# EAGLE design rc2014_6809 (EAGLE 8.1.1)
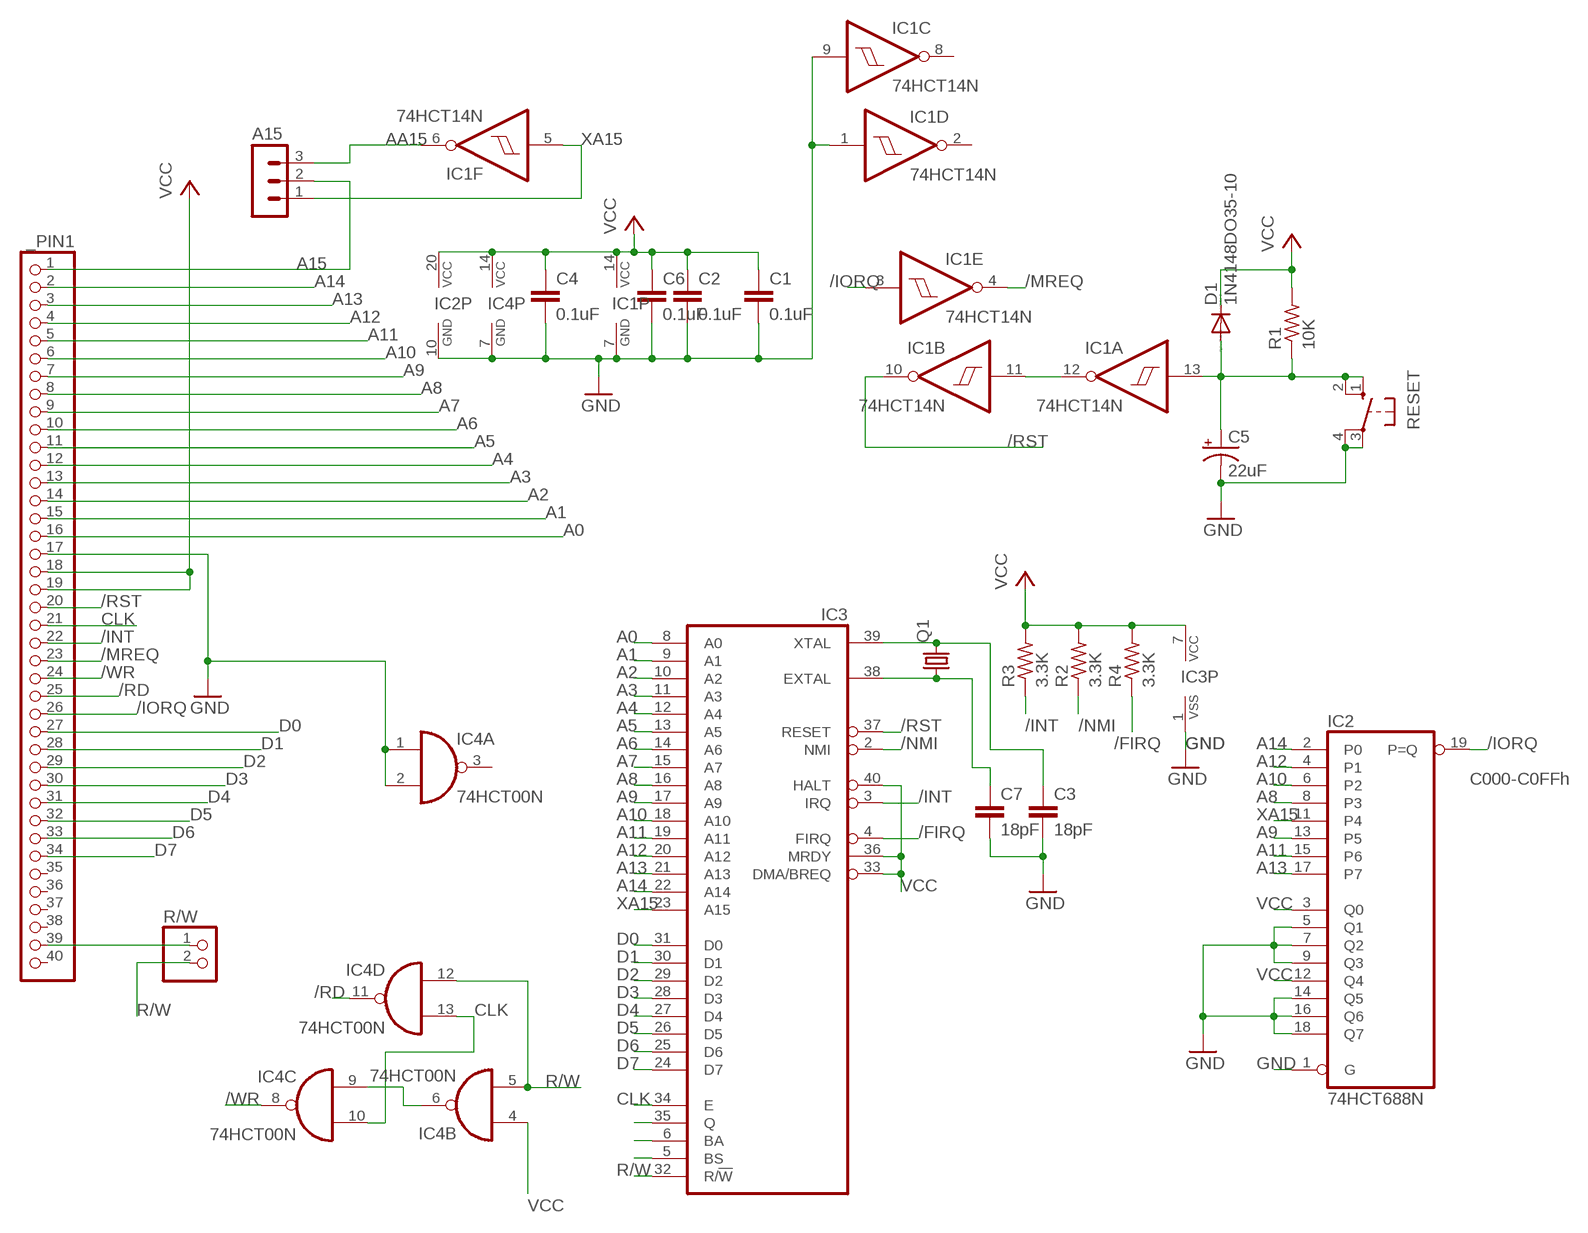
[diagram p0: schematic, sheet 1]

## Parts
_PIN1  PINHD-1X40  [1X40]
A15  MA03-1  [MA03-1]
C1  0.1uF  C-EU050-024X044  [C050-024X044]
C2  0.1uF  C-EU050-024X044  [C050-024X044]
C3  18pF  C-EU050-024X044  [C050-024X044]
C4  0.1uF  C-EU050-024X044  [C050-024X044]
C5  22uF  CPOL-USTAP5-80  [TAP5-80]
C6  0.1uF  C-EU050-024X044  [C050-024X044]
C7  18pF  C-EU050-024X044  [C050-024X044]
D1  1N4148DO35-10  [DO35-10]
IC1  74HCT14N  [DIL14]
IC2  74HCT688N  [DIL20]
IC3  6809  [DIL40]
IC4  74HCT00N  [DIL14]
Q1  CRYSTALHC49S  [HC49/S]
R1  10K  R-US_0207/10  [0207/10]
R2  3.3K  R-US_0207/10  [0207/10]
R3  3.3K  R-US_0207/10  [0207/10]
R4  3.3K  R-US_0207/10  [0207/10]
R/W  PINHD-1X2  [1X02]
RESET  10-XX  [B3F-10XX]

## Nets
/FIRQ: IC3.4(FIRQ) R4.1
/INT: _PIN1.22 IC3.3(IRQ) R3.1
/IORQ: _PIN1.26 IC1.3(E:I) IC2.19(P=Q)
/MREQ: _PIN1.23 IC1.4(E:O)
/NMI: IC3.2(NMI) R2.1
/RD: _PIN1.25 IC4.11(D:O)
/RST: _PIN1.20 IC1.10(B:O) IC3.37(RESET)
/WR: _PIN1.24 IC4.8(C:O)
A0: _PIN1.16 IC3.8(A0)
A1: _PIN1.15 IC3.9(A1)
A2: _PIN1.14 IC3.10(A2)
A3: _PIN1.13 IC3.11(A3)
A4: _PIN1.12 IC3.12(A4)
A5: _PIN1.11 IC3.13(A5)
A6: _PIN1.10 IC3.14(A6)
A7: _PIN1.9 IC3.15(A7)
A8: _PIN1.8 IC2.8(P3) IC3.16(A8)
A9: _PIN1.7 IC2.13(P5) IC3.17(A9)
A10: _PIN1.6 IC2.6(P2) IC3.18(A10)
A11: _PIN1.5 IC2.15(P6) IC3.19(A11)
A12: _PIN1.4 IC2.4(P1) IC3.20(A12)
A13: _PIN1.3 IC2.17(P7) IC3.21(A13)
A14: _PIN1.2 IC2.2(P0) IC3.22(A14)
A15: _PIN1.1 A15.2
AA15: A15.3 IC1.6(F:O)
CLK: _PIN1.21 IC3.34(E) IC4.10(C:I1) IC4.13(D:I1)
D0: _PIN1.27 IC3.31(D0)
D1: _PIN1.28 IC3.30(D1)
D2: _PIN1.29 IC3.29(D2)
D3: _PIN1.30 IC3.28(D3)
D4: _PIN1.31 IC3.27(D4)
D5: _PIN1.32 IC3.26(D5)
D6: _PIN1.33 IC3.25(D6)
D7: _PIN1.34 IC3.24(D7)
GND: _PIN1.17 C1.2 C2.2 C3.2 C4.2 C5.- C6.2 C7.2 IC1.1(D:I) IC1.7(P:GND) IC1.9(C:I) IC2.1(G) IC2.5(Q1) IC2.7(Q2) IC2.9(Q3) IC2.10(GND) IC2.14(Q5) IC2.16(Q6) IC2.18(Q7) IC3.1(VSS) IC4.1(A:I0) IC4.2(A:I1) IC4.7(P:GND) RESET.3(P) RESET.4(P1)
N$1: IC4.6(B:O) IC4.9(C:I0)
N$3: IC3.5(BS)
N$4: IC3.6(BA)
N$5: IC3.35(Q)
N$6: _PIN1.39 R/W.1
N$15: IC1.11(B:I) IC1.12(A:O)
N$32: C3.1 IC3.39(XTAL) Q1.2
N$33: C7.1 IC3.38(EXTAL) Q1.1
R/W: IC3.32(R/!W) IC4.5(B:I1) IC4.12(D:I0) R/W.2
RESET: C5.+ D1.A IC1.13(A:I) R1.1 RESET.1(S) RESET.2(S1)
VCC: _PIN1.18 _PIN1.19 C1.1 C2.1 C4.1 C6.1 D1.C IC1.14(P:VCC) IC2.3(Q0) IC2.12(Q4) IC2.20(VCC) IC3.7(VCC) IC3.33(DMA/BREQ) IC3.36(MRDY) IC3.40(HALT) IC4.4(B:I0) IC4.14(P:VCC) R1.2 R2.2 R3.2 R4.2
XA15: A15.1 IC1.5(F:I) IC2.11(P4) IC3.23(A15)
Unconnected: _PIN1.35 _PIN1.36 _PIN1.37 _PIN1.38 _PIN1.40 IC1.2(D:O) IC1.8(C:O) IC4.3(A:O)

## Notes on the sheet
- C000-C0FFh

## Library data of the parts
_PIN1 = pinhead:PINHD-1X40: PIN HEADER
A15 = con-lstb:MA03-1: PIN HEADER; OC_FARNELL: unknown; OC_NEWARK: unknown
C1-C4 C6 C7 = rcl:C-EU: CAPACITOR, European symbol
C5 = rcl:CPOL-US: POLARIZED CAPACITOR, American symbol
D1 = diode:1N4148: DIODE high speed (Philips)
IC1 = 74xx-eu:74*14: Hex schmitt trigger INVERTER
IC2 = 74xx-eu:74*688: 8-bit MAGNITUDE/IDENTITY COMPARATOR, totem pole
IC3 = micro-motorola:6809: MICROCONTROLLER/MEMORY DEVICE; MF: NTE ELECTRONICS; MPN: NTE6809; OC_FARNELL: 4530354; OC_NEWARK: 31C2459
IC4 = 74xx-eu:74*00: Quad 2-input NAND gate
Q1 = crystal:CRYSTAL: CRYSTAL; OC_FARNELL: 1667008; OC_NEWARK: unknown
R1-R4 = rcl:R-US_: RESISTOR, American symbol
R/W = pinhead:PINHD-1X2: PIN HEADER
RESET = switch-omron:10-XX: OMRON SWITCH; MPN: B3F-1000; OC_FARNELL: 176432; OC_NEWARK: 36M3542

## Net classes
0 +5V: width 0.508 mm

## Board
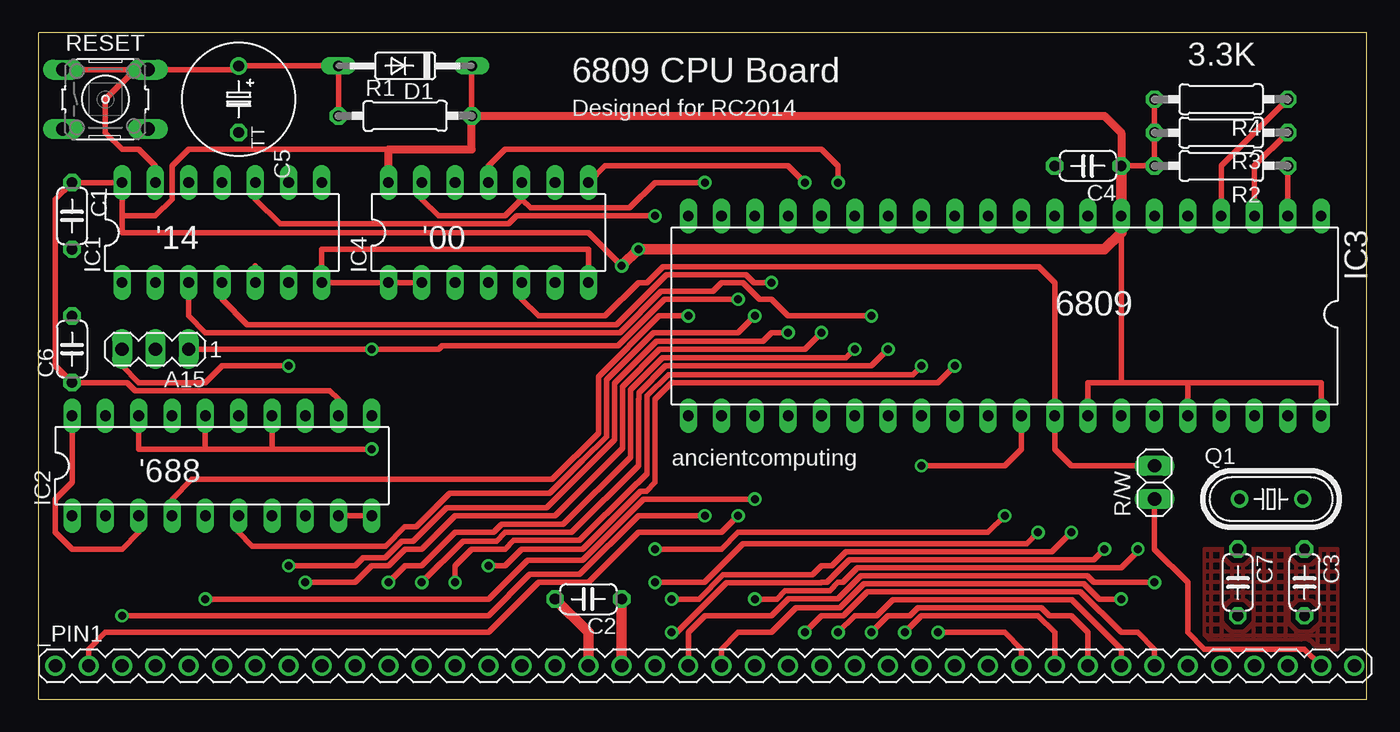
[diagram p1: board, top side]
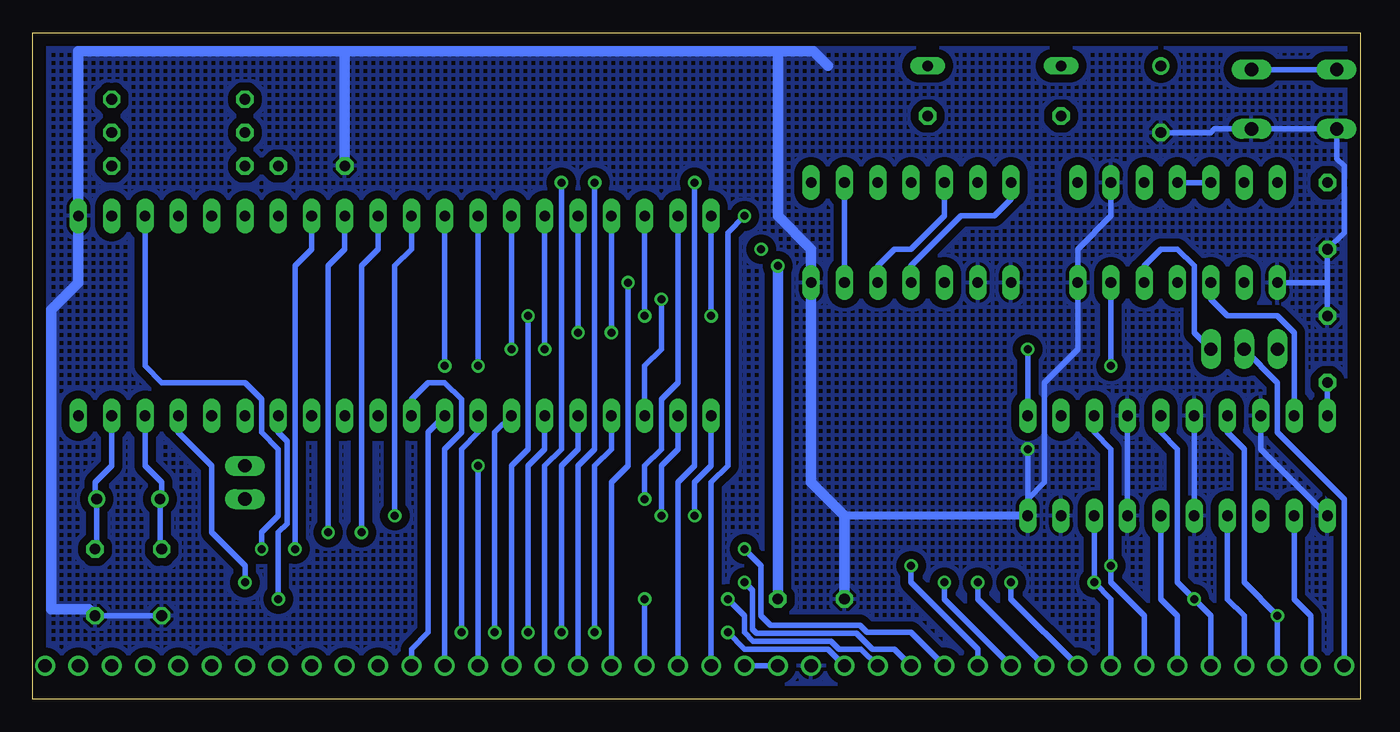
[diagram p2: board, bottom side, seen from below]

Size 101.27 x 50.79 mm. Coordinates in mm from the lower left corner, seen from the top.
Outline: 0,0 101.27,0 101.27,50.79 0,50.79 0,0
Copper layers (1*16): Top 0.035mm / dielectric 1.5mm / Bottom 0.035mm
Design rules "default *": minimum track width 20mil, minimum drill 24mil, track to track 8mil, track to pad 8mil, pad to pad 8mil, via to via 8mil, smd to smd 8mil, copper to edge 40mil, drill to drill 8mil, minimum pad ring 10mil, minimum via ring 8mil, stop-mask expansion 4mil, vias tented up to drill 0mil, thermal gap 10mil

### Footprints (pad centres in the part's own frame; a part is rotated, then mirrored left to right if it is on the bottom)
1X40 = drill 1.016: 1 -49.53,0; 2 -46.99,0; 3 -44.45,0; 4 -41.91,0; 5 -39.37,0; 6 -36.83,0; 7 -34.29,0; 8 -31.75,0; 9 -29.21,0; 10 -26.67,0; 11 -24.13,0; 12 -21.59,0; 13 -19.05,0; 14 -16.51,0; 15 -13.97,0; 16 -11.43,0; 17 -8.89,0; 18 -6.35,0; 19 -3.81,0; 20 -1.27,0; 21 1.27,0; 22 3.81,0; 23 6.35,0; 24 8.89,0; 25 11.43,0; 26 13.97,0; 27 16.51,0; 28 19.05,0; 29 21.59,0; 30 24.13,0; 31 26.67,0; 32 29.21,0; 33 31.75,0; 34 34.29,0; 35 36.83,0; 36 39.37,0; 37 41.91,0; 38 44.45,0; 39 46.99,0; 40 49.53,0
MA03-1 = drill 1.016 long: 1 -2.54,0; 2 0,0; 3 2.54,0
C050-024X044 = drill 0.813 octagon: 1 -2.54,0; 2 2.54,0
TAP5-80 = drill 0.813: + -2.54,0 | drill 0.813 octagon: - 2.54,0
DO35-10 = drill 0.813 long: A 5.08,0; C -5.08,0
DIL14 = drill 0.813 long: 1 -7.62,-3.81; 2 -5.08,-3.81; 3 -2.54,-3.81; 4 0,-3.81; 5 2.54,-3.81; 6 5.08,-3.81; 7 7.62,-3.81; 8 7.62,3.81; 9 5.08,3.81; 10 2.54,3.81; 11 0,3.81; 12 -2.54,3.81; 13 -5.08,3.81; 14 -7.62,3.81
DIL20 = drill 0.813 long: 1 -11.43,-3.81; 2 -8.89,-3.81; 3 -6.35,-3.81; 4 -3.81,-3.81; 5 -1.27,-3.81; 6 1.27,-3.81; 7 3.81,-3.81; 8 6.35,-3.81; 9 8.89,-3.81; 10 11.43,-3.81; 11 11.43,3.81; 12 8.89,3.81; 13 6.35,3.81; 14 3.81,3.81; 15 1.27,3.81; 16 -1.27,3.81; 17 -3.81,3.81; 18 -6.35,3.81; 19 -8.89,3.81; 20 -11.43,3.81
DIL40 = drill 0.813 long: 1 -24.13,-7.62; 2 -21.59,-7.62; 3 -19.05,-7.62; 4 -16.51,-7.62; 5 -13.97,-7.62; 6 -11.43,-7.62; 7 -8.89,-7.62; 8 -6.35,-7.62; 9 -3.81,-7.62; 10 -1.27,-7.62; 11 1.27,-7.62; 12 3.81,-7.62; 13 6.35,-7.62; 14 8.89,-7.62; 15 11.43,-7.62; 16 13.97,-7.62; 17 16.51,-7.62; 18 19.05,-7.62; 19 21.59,-7.62; 20 24.13,-7.62; 21 24.13,7.62; 22 21.59,7.62; 23 19.05,7.62; 24 16.51,7.62; 25 13.97,7.62; 26 11.43,7.62; 27 8.89,7.62; 28 6.35,7.62; 29 3.81,7.62; 30 1.27,7.62; 31 -1.27,7.62; 32 -3.81,7.62; 33 -6.35,7.62; 34 -8.89,7.62; 35 -11.43,7.62; 36 -13.97,7.62; 37 -16.51,7.62; 38 -19.05,7.62; 39 -21.59,7.62; 40 -24.13,7.62
HC49/S = drill 0.813: 1 -2.413,0; 2 2.413,0
0207/10 = drill 0.813 octagon: 1 -5.08,0; 2 5.08,0
1X02 = drill 1.016 long: 1 -1.27,0; 2 1.27,0
B3F-10XX = drill 1.016 long: 1 -3.251,2.261; 2 3.251,2.261; 3 -3.251,-2.261; 4 3.251,-2.261

### Placement (x,y rotation side)
_PIN1  50.8,2.54 0 top
A15  8.89,26.67 180 top
C1  2.54,36.83 270 top
C2  41.91,7.62 180 top
C3  96.52,8.89 270 top
C4  80.01,40.64 180 top
C5  15.24,45.72 270 top
C6  2.54,26.67 90 top
C7  91.44,8.89 270 top
D1  27.94,48.26 180 top
IC1  13.97,35.56 0 top
IC2  13.97,17.78 0 top
IC3  73.66,29.21 180 top
IC4  34.29,35.56 0 top
Q1  93.98,15.24 0 top
R1  27.94,44.45 0 top
R2  90.17,40.64 180 top
R3  90.17,43.18 180 top
R4  90.17,45.72 180 top
R/W  85.09,16.51 90 top
RESET  5.08,45.72 0 top

### Tracks (layer width: path | path; a pad name or v marks a point on that pad's centre or on a via)
/FIRQ
  Top 0.406: R4.1 90.17,40.64 IC3.4
/INT  (via drill 0.61)
  Top 0.406: v54.61,7.62 56.29,7.62 56.92,8.25 60.32,8.25 60.96,8.89 61.32,8.89 62.44,10.01 82.55,10.01 83.82,11.28 v83.82,11.43 | R3.1 92.71,40.64 IC3.3
  Bottom 0.406: _PIN1.22 v54.61,7.62 | IC3.3 92.71,25.4 91.44,24.13 85.09,24.13 83.82,22.86 83.82,20.32 82.55,19.05 82.55,13.97 83.82,12.7 v83.82,11.43
/IORQ  (via drill 0.61)
  Top 0.406: IC1.3 11.43,29.21 12.7,27.94 44.31,27.94 47.46,31.09 51.41,31.09 52.07,31.75 53.7,31.75 54.97,30.48 55.88,30.48 57.15,29.21 v63.5,29.21
  Bottom 0.406: _PIN1.26 64.77,17.78 63.5,19.05 v63.5,29.21 | IC1.3 11.43,30.48 10.16,29.21 6.35,29.21 5.08,27.94 IC2.19
/MREQ  (via drill 0.61)
  Top 0.406: IC1.4 13.97,30.48 15.9,28.55 44.06,28.55 47.87,32.36 53.95,32.36 54.56,31.75 v55.88,31.75
  Bottom 0.406: _PIN1.23 57.15,16.51 55.88,17.78 v55.88,31.75
/NMI
  Top 0.406: R2.1 IC3.2
/RD  (via drill 0.61)
  Top 0.406: v60.96,39.37 60.96,40.64 59.69,41.91 35.56,41.91 34.29,40.64 IC4.11
  Bottom 0.406: _PIN1.25 62.23,17.78 60.96,19.05 v60.96,39.37
/RST  (via drill 0.61)
  Top 0.406: v85.09,8.89 80.46,8.89 79.96,9.4 62.69,9.4 60.94,7.64 57.17,7.64 55.88,6.35 50.8,6.35 49.53,5.08 _PIN1.20 | v46.99,36.83 36.42,36.83 35.81,36.22 18.39,36.22 16.51,38.1 IC1.10
  Bottom 0.406: IC3.37 90.17,20.32 87.63,17.78 87.63,12.7 85.09,10.16 v85.09,8.89 | _PIN1.20 49.53,16.51 48.26,17.78 48.26,35.56 v46.99,36.83
/WR  (via drill 0.61)
  Top 0.406: v58.42,39.37 57.15,40.64 43.18,40.64 IC4.8
  Bottom 0.406: _PIN1.24 59.69,17.78 58.42,19.05 v58.42,39.37
A0  (via drill 0.61)
  Top 0.406: v48.26,5.08 48.67,5.08 52.45,8.86 59.66,8.86 59.69,8.89 60.1,8.89 61.83,10.62 80.47,10.62 v81.28,11.43
  Bottom 0.406: _PIN1.16 40.64,3.81 46.99,3.81 v48.26,5.08 | IC3.8 80.01,34.29 81.28,33.02 v81.28,11.43
A1  (via drill 0.61)
  Top 0.406: v48.26,7.62 50.35,7.62 52.2,9.47 59,9.47 59.69,10.16 60.51,10.16 61.57,11.23 77.27,11.23 v78.74,12.7
  Bottom 0.406: _PIN1.15 38.1,3.81 39.78,3.81 40.39,4.42 46.33,4.42 46.99,5.08 46.99,6.35 v48.26,7.62 | IC3.9 77.47,34.29 78.74,33.02 v78.74,12.7
A2  (via drill 0.61)
  Top 0.406: v46.99,8.89 50.75,8.89 53.7,11.84 75.34,11.84 v76.2,12.7
  Bottom 0.406: _PIN1.14 35.56,3.81 37.24,3.81 38.46,5.03 46.08,5.03 46.38,5.33 46.38,8.28 v46.99,8.89 | IC3.10 74.93,34.29 76.2,33.02 v76.2,12.7
A3  (via drill 0.61)
  Top 0.406: v46.99,11.43 52.07,11.43 53.34,12.7 72.39,12.7 v73.66,13.97
  Bottom 0.406: IC3.11 72.39,34.29 73.66,33.02 v73.66,13.97 | _PIN1.13 34.29,5.08 37.65,5.08 38.2,5.64 45.01,5.64 45.72,6.35 45.72,10.16 v46.99,11.43
A4  (via drill 0.61)
  Top 0.406: v69.85,25.4 68.58,24.13 48.26,24.13 46.99,22.86 46.99,16.51 46.33,15.85 45.88,15.85 41.46,11.43 36.83,11.43 35.56,10.16 v34.29,10.16
  Bottom 0.406: IC3.12 v69.85,25.4 | _PIN1.12 29.21,3.81 34.29,8.89 v34.29,10.16
A5  (via drill 0.61)
  Top 0.406: v67.31,25.4 66.65,24.74 48.01,24.74 46.38,23.11 46.38,17.17 45.67,16.46 45.62,16.46 45.27,16.1 | 45.27,16.1 | 45.27,16.1 41.25,12.09 36.22,12.09 35.56,11.43 33.02,11.43 31.75,10.16 v31.75,8.89
  Bottom 0.406: _PIN1.11 31.75,7.62 v31.75,8.89 | IC3.13 v67.31,25.4
A6  (via drill 0.61)
  Top 0.406: v64.77,26.67 63.5,25.4 47.81,25.4 45.77,23.36 45.77,22.91 45.72,22.86 45.72,17.78 40.64,12.7 35.56,12.7 34.9,12.04 32.36,12.04 v29.21,8.89
  Bottom 0.406: _PIN1.10 29.21,7.62 v29.21,8.89 | IC3.14 v64.77,26.67
A7  (via drill 0.61)
  Top 0.406: v26.67,8.89 27.94,10.16 29.21,10.16 31.75,12.7 34.7,12.7 35.31,13.31 39.98,13.31 45.11,18.44 45.11,23.57 47.55,26.01 61.57,26.01 v62.23,26.67
  Bottom 0.406: _PIN1.9 26.67,7.62 v26.67,8.89 | IC3.15 v62.23,26.67
A8  (via drill 0.61)
  Top 0.406: v59.69,27.94 58.42,26.67 47.35,26.67 44.5,23.82 44.5,19.1 39.37,13.97 31.75,13.97 29.21,11.43 27.94,11.43 26.67,10.16 25.4,10.16 24.13,8.89 v20.32,8.89
  Bottom 0.406: _PIN1.8 19.05,7.62 v20.32,8.89 IC2.8 | IC3.16 v59.69,27.94
A9  (via drill 0.61)
  Top 0.406: v57.15,27.94 55.88,27.94 55.22,27.28 47.1,27.28 43.89,24.07 43.89,19.76 38.71,14.58 31.09,14.58 28.55,12.04 27.69,12.04 26.42,10.77 24.74,10.77 24.13,10.16 v19.05,10.16
  Bottom 0.406: IC3.17 v57.15,27.94 | _PIN1.7 16.51,6.35 19.05,8.89 v19.05,10.16 19.05,19.05 20.32,20.32 IC2.13
A10  (via drill 0.61)
  Top 0.406: v54.61,29.21 53.34,27.94 46.9,27.94 43.28,24.32 43.28,20.01 41.48,18.21 38.94,15.67 31.32,15.67 28.78,13.13 27.92,13.13 26.44,11.66 16.28,11.66 15.24,12.7 IC2.6
  Bottom 0.406: _PIN1.6 13.97,6.35 15.24,7.62 IC2.6 | IC3.18 v54.61,29.21
A11  (via drill 0.61)
  Top 0.406: v54.61,15.24 46.13,15.24 41.48,10.59 37.26,10.59 34.29,7.62 v12.7,7.62
  Bottom 0.406: IC3.19 52.07,24.13 53.34,22.86 53.34,19.05 54.61,17.78 v54.61,15.24 | _PIN1.5 11.43,6.35 v12.7,7.62 13.97,8.89 13.97,19.05 15.24,20.32 IC2.15
A12  (via drill 0.61)
  Top 0.406: v49.53,29.21 47.3,29.21 42.67,24.58 42.67,20.27 39.14,16.74 11.66,16.74 10.16,15.24 IC2.4
  Bottom 0.406: _PIN1.4 8.89,6.35 10.16,7.62 IC2.4 | IC3.20 v49.53,29.21
A13  (via drill 0.61)
  Top 0.406: v50.8,13.97 45.72,13.97 41.25,9.5 37.44,9.5 34.29,6.35 v6.35,6.35
  Bottom 0.406: _PIN1.3 v6.35,6.35 8.89,8.89 8.89,19.05 10.16,20.32 IC2.17 | IC3.21 49.53,17.78 50.8,16.51 v50.8,13.97
A14  (via drill 0.61)
  Top 0.406: v53.34,13.97 52.07,12.7 45.72,12.7 41.91,8.89 38.1,8.89 34.29,5.08 5.08,5.08 3.81,3.81 _PIN1.2
  Bottom 0.406: _PIN1.2 3.81,6.35 5.08,7.62 IC2.2 | IC3.22 52.07,19.05 53.34,17.78 v53.34,13.97
A15
  Bottom 0.406: A15.2 6.35,24.13 6.35,20.32 1.27,15.24 _PIN1.1
AA15  (via drill 0.61)
  Top 0.406: A15.3 6.35,25.4 7.62,24.13 12.7,24.13 13.97,25.4 v19.05,25.4
  Bottom 0.406: IC1.6 v19.05,25.4
CLK  (via drill 0.61)
  Top 0.406: v82.55,7.62 80.87,7.62 79.7,8.79 62.94,8.79 61.12,6.96 57.76,6.96 55.88,5.08 53.34,5.08 52.07,3.81 _PIN1.21 | IC4.13 29.21,38.1 30.48,36.83 35.56,36.83 36.83,38.1 | 36.83,38.1 IC4.10 | v50.8,39.37 46.99,39.37 45.06,37.44 37.49,37.44 36.83,38.1
  Bottom 0.406: _PIN1.21 52.07,16.51 50.8,17.78 v50.8,39.37 | IC3.34 82.55,20.32 81.89,19.66 81.89,13.36 82.55,12.7 v82.55,7.62
D0  (via drill 0.61)
  Top 0.406: v67.31,17.78 73.66,17.78 74.93,19.05 IC3.31
  Bottom 0.406: v67.31,17.78 _PIN1.27
D1
  Bottom 0.406: _PIN1.28 69.85,19.05 68.58,20.32 68.58,22.86 69.85,24.13 71.12,24.13 72.39,22.86 IC3.30
D2
  Bottom 0.406: IC3.29 71.12,20.32 71.12,5.08 72.39,3.81 _PIN1.29
D3  (via drill 0.61)
  Top 0.406: v68.58,5.08 73.66,5.08 74.93,3.81 _PIN1.30
  Bottom 0.406: v68.58,5.08 68.58,19.05 67.31,20.32 IC3.28
D4  (via drill 0.61)
  Top 0.406: v66.04,5.08 67.31,6.35 76.2,6.35 77.47,5.08 _PIN1.31
  Bottom 0.406: IC3.27 66.04,20.32 v66.04,5.08
D5  (via drill 0.61)
  Top 0.406: v63.5,5.08 64.77,6.35 66.45,6.35 67.06,6.96 76.45,6.96 77.06,6.35 78.74,6.35 80.01,5.08 _PIN1.32
  Bottom 0.406: IC3.26 62.23,19.05 63.5,17.78 v63.5,5.08
D6  (via drill 0.61)
  Top 0.406: v60.96,5.08 62.23,6.35 63.91,6.35 65.13,7.57 78.79,7.57 82.55,3.81 _PIN1.33
  Bottom 0.406: IC3.25 59.69,19.05 60.96,17.78 v60.96,5.08
D7  (via drill 0.61)
  Top 0.406: v58.42,5.08 59.69,6.35 61.37,6.35 63.2,8.18 79.45,8.18 82.55,5.08 83.82,5.08 85.09,3.81 _PIN1.34
  Bottom 0.406: IC3.24 57.15,19.05 58.42,17.78 v58.42,5.08
GND  (via drill 0.61)
  Top 0.406: IC2.10 IC2.9 | IC4.2 IC4.1 IC1.7 21.59,34.29 41.91,34.29 IC4.7 | IC2.18 7.62,19.05 12.7,19.05 | 12.7,19.05 17.78,19.05 | 17.78,19.05 IC2.14 | 12.7,19.05 IC2.16 | 17.78,19.05 v25.4,19.05
  Top 0.813: C2.2 41.91,5.08 _PIN1.17
  Bottom 0.406: C3.2 C7.2 | IC2.1 7.62,19.05 IC2.18 | IC2.5 IC2.16 | IC2.7 IC2.14 | IC1.9 19.05,36.83 21.59,34.29 IC1.7 21.59,26.67 24.13,24.13 24.13,16.51 25.4,15.24 | C5.- 11.43,43.18 11.15,43.46 RESET.4 RESET.3 1.83,41.2 1.27,40.64 1.27,35.56 C1.2 2.54,31.75 | 2.54,31.75 C6.2 | IC1.1 2.54,31.75 | 25.4,15.24 v25.4,19.05 | 25.4,15.24 IC2.10
  Bottom 0.61: IC2.10 39.37,13.97
  Bottom 0.813: C3.2 97,6.83 99.85,6.83 99.85,29.69 97.79,31.75 IC3.1 97.79,49.37 77.47,49.37 | 77.47,49.37 44.45,49.37 | 44.45,49.37 41.75,49.37 40.64,48.26 | C2.2 39.37,13.97 41.91,16.51 IC4.7 41.91,34.29 44.45,36.83 44.45,49.37 | C4.2 77.47,49.37
  pour Bottom (isolate 0.61, hatched): 0,50.8 0,0 101.6,0 101.6,50.8
N$1
  Bottom 0.406: IC4.9 IC4.6
N$2
  pour Top (isolate 0.406, hatched): 88.9,11.43 88.9,3.81 99.06,3.81 99.06,11.43
N$6
  Top 0.406: R/W.1 85.09,11.43 87.63,8.89 87.63,5.08 88.9,3.81 96.52,3.81 _PIN1.39
N$15
  Bottom 0.406: IC1.12 IC1.11
N$32
  Bottom 0.406: IC3.39 95.25,17.78 96.52,16.51 96.52,15.37 Q1.2 96.39,11.56 C3.1
N$33
  Bottom 0.406: IC3.38 92.71,17.78 91.44,16.51 91.44,15.37 Q1.1 91.57,11.56 C7.1
R/W
  Top 0.406: IC4.5 36.83,30.48 38.1,29.21 43.18,29.21 45.72,31.75 46.4,31.75 47.62,32.97 76.25,32.97 77.47,31.75 IC3.32 77.47,19.05 78.74,17.78 R/W.2
  Bottom 0.406: IC4.12 31.75,36.83 34.29,34.29 35.56,34.29 36.83,33.02 IC4.5
RESET
  Top 0.406: RESET.1 7.34,47.98 | 7.34,47.98 7.62,48.26 | R1.1 D1.A C5.+ 14.96,47.98 RESET.2 7.34,47.98 | 7.34,47.98 5.08,45.72 5.08,43.18 6.35,41.91 7.62,41.91 8.89,40.64 IC1.13
  Bottom 0.406: RESET.2 RESET.1
VCC  (via drill 0.61)
  Top 0.406: D1.C R1.2 | IC1.14 C1.1 1.27,38.1 1.27,25.4 C6.1 6.76,24.13 7.37,23.52 22.2,23.52 22.86,22.86 IC2.12 | IC3.36 87.63,24.13 | 87.63,24.13 97.79,24.13 IC3.40 | 82.55,24.13 87.63,24.13 | 82.55,24.13 80.01,24.13 IC3.33 | R4.2 R3.2 R2.2 C4.1 | 26.67,41.91 11.43,41.91 10.16,40.64 10.16,38.1 8.89,36.83 6.35,36.83 | IC1.14 6.35,38.1 | IC2.20 2.54,16.51 1.27,15.24 1.27,12.7 2.54,11.43 6.35,11.43 7.62,12.7 IC2.3 | v44.45,33.02 41.91,35.56 6.35,35.56 6.35,36.83 | 6.35,36.83 IC1.14 | IC3.7 82.55,24.13
  Top 0.61: IC4.14 26.67,41.91 33.02,41.91 R1.2 81.28,44.45 82.55,43.18 C4.1
  Top 0.813: _PIN1.18 C2.1 | C4.1 IC3.7 82.55,35.56 81.28,34.29 v45.72,34.29 v44.45,33.02
  Bottom 0.406: _PIN1.18 _PIN1.19 | IC2.20 C6.1 | IC4.4 34.29,33.02 30.48,36.83 27.94,36.83 26.67,38.1 IC4.14
  Bottom 0.813: C2.1 v44.45,33.02
XA15  (via drill 0.61)
  Top 0.406: IC1.5 16.51,33.02 | A15.1 v25.4,26.67 30.48,26.67 30.75,26.94 44.18,26.94 47.71,30.48 v53.34,30.48
  Bottom 0.406: A15.1 12.7,27.94 12.7,33.02 13.97,34.29 15.24,34.29 16.51,33.02 IC1.5 | IC2.11 v25.4,26.67 | IC3.23 54.61,25.4 53.34,26.67 v53.34,30.48

### Text on the board
tNames: 3.3K | 6809 CPU Board | Designed for RC2014 | '14 | '00 | 6809 | ancientcomputing | '688